# Altium project ESP-Project.PrjPcb
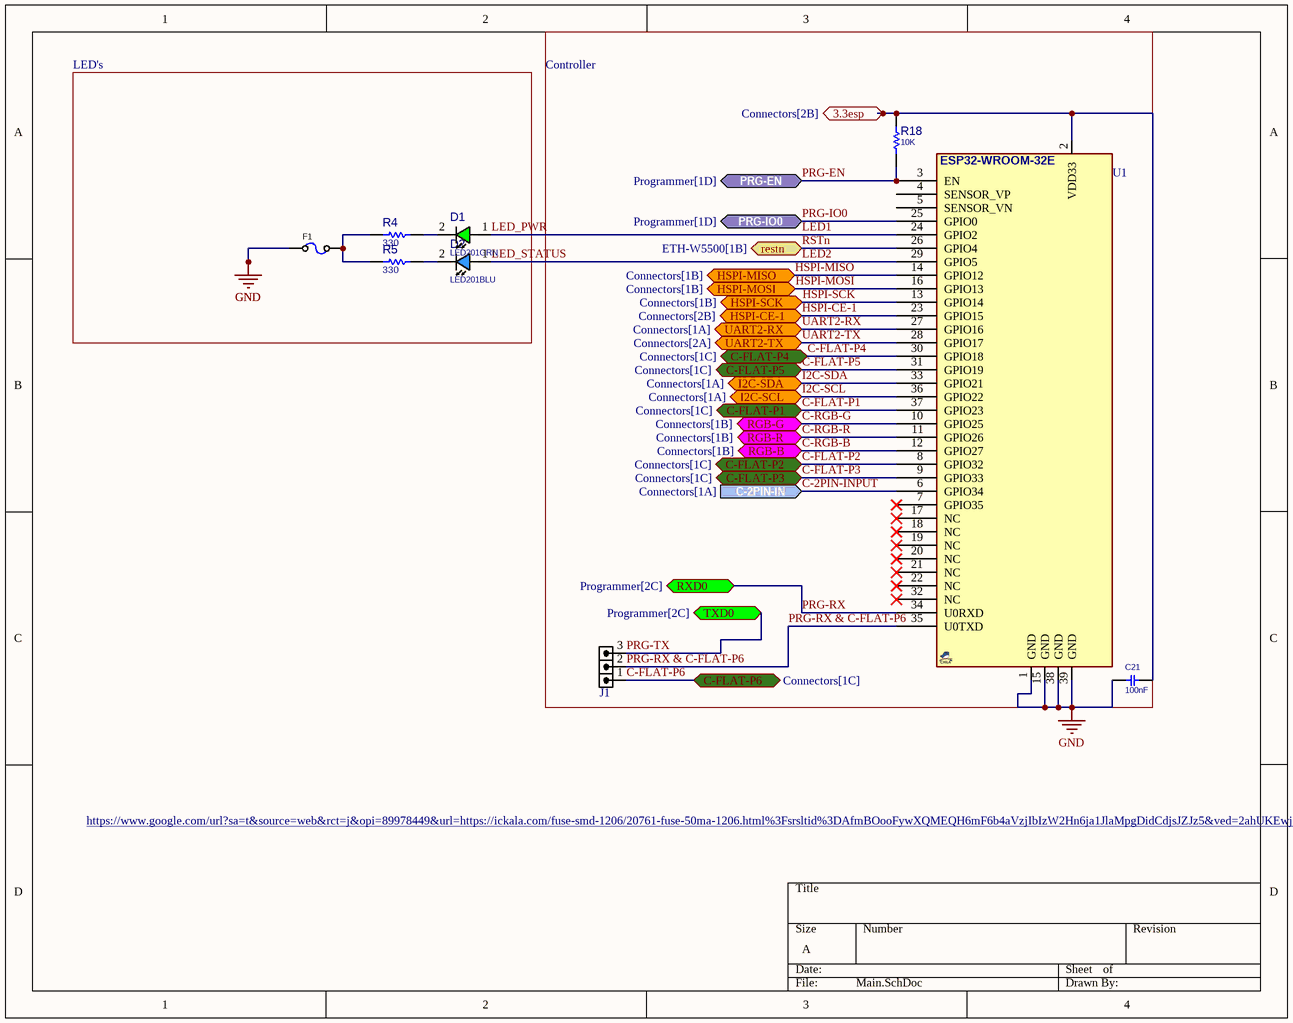
[diagram p0: Main.SchDoc]
5 sheets, 105 parts. Net scope: flat (ports and power ports of the same name join across sheets).
Board file: PCB1.PcbDoc
Sheets:
  Main.SchDoc
  ETH-W5500.SchDoc
  Programmer.SchDoc
  Power.SchDoc
  Connectors.SchDoc

## Sheet Main.SchDoc
size A; SheetNumber: 1; SheetTotal: 5

### Parts
C21  100nF  [C_CERM_D3]
D1  LED201GRN  [LED0201GRN]
D2  LED201BLU  [LED0201BLU]
F1  (no value)  [F1206]
J1  HDRM3  [HDR_M_1X3]  (value not drawn)
R4  330  [R0402]
R5  330  [R0402]
R18  10K  [R025W_AX04]
U1  ESP32-WROOM-32E  [ESP32S]  (value not drawn)

### Blocks framed on the sheet
LED's: D1 D2 F1 R4 R5
Controller: C21 J1 R18 U1

### Ports
3.3esp (bidir, see Connectors[2B]), C-2PIN-IN (in, see Connectors[1A]), C-FLAT-P1 (bidir, see Connectors[1C]), C-FLAT-P2 (bidir, see Connectors[1C]), C-FLAT-P3 (bidir, see Connectors[1C]), C-FLAT-P4 (bidir, see Connectors[1C]), C-FLAT-P5 (bidir, see Connectors[1C]), C-FLAT-P6 (bidir, see Connectors[1C]), HSPI-CE-1 (bidir, see Connectors[2B]), HSPI-MISO (bidir, see Connectors[1B]), HSPI-MOSI (bidir, see Connectors[1B]), HSPI-SCK (bidir, see Connectors[1B]), I2C-SCL (bidir, see Connectors[1A]), I2C-SDA (bidir, see Connectors[1A]), PRG-EN (bidir, see Programmer[1D]), PRG-IO0 (bidir, see Programmer[1D]), restn (bidir, see ETH-W5500[1B]), RGB-B (bidir, see Connectors[1B]), RGB-G (bidir, see Connectors[1B]), RGB-R (bidir, see Connectors[1B]), RXD0 (bidir, see Programmer[2C]), TXD0 (bidir, see Programmer[2C]), UART2-RX (bidir, see Connectors[1A]), UART2-TX (bidir, see Connectors[2A])

### Nets
GND: C21.1 F1.1 U1.1(GND) U1.15(GND) U1.38(GND) U1.39(GND)
3v3.: C21.2 R18.2 U1.2(VDD33) ; port 3.3esp
C-2PIN-INPUT: U1.6(GPIO34) ; port C-2PIN-IN
C-FLAT-P1: U1.37(GPIO23) ; port C-FLAT-P1
C-FLAT-P2: U1.8(GPIO32) ; port C-FLAT-P2
C-FLAT-P3: U1.9(GPIO33) ; port C-FLAT-P3
C-FLAT-P4: U1.30(GPIO18) ; port C-FLAT-P4
C-FLAT-P5: U1.31(GPIO19) ; port C-FLAT-P5
C-FLAT-P6: J1.1 ; port C-FLAT-P6
C-RGB-B: U1.12(GPIO27) ; port RGB-B
C-RGB-G: U1.10(GPIO25) ; port RGB-G
C-RGB-R: U1.11(GPIO26) ; port RGB-R
HSPI-CE-1: U1.23(GPIO15) ; port HSPI-CE-1
HSPI-MISO: U1.14(GPIO12) ; port HSPI-MISO
HSPI-MOSI: U1.16(GPIO13) ; port HSPI-MOSI
HSPI-SCK: U1.13(GPIO14) ; port HSPI-SCK
I2C-SCL: U1.36(GPIO22) ; port I2C-SCL
I2C-SDA: U1.33(GPIO21) ; port I2C-SDA
LED1: D1.1(ANODE) U1.24(GPIO2)  [also labelled LED_PWR]
LED2: D2.1(ANODE) U1.29(GPIO5)  [also labelled LED_STATUS]
PRG-EN: R18.1 U1.3(EN) ; port PRG-EN
PRG-IO0: U1.25(GPIO0) ; port PRG-IO0
PRG-RX: U1.34(U0RXD) ; port RXD0
PRG-RX & C-FLAT-P6: J1.2 U1.35(U0TXD)
PRG-TX: J1.3 ; port TXD0
RSTn: U1.26(GPIO4) ; port restn  [project net restn]
UART2-RX: U1.27(GPIO16) ; port UART2-RX
UART2-TX: U1.28(GPIO17) ; port UART2-TX
NetD1_2: D1.2(CATHODE) R4.2
NetD2_2: D2.2(CATHODE) R5.2
NetF1_2: F1.2 R4.1 R5.1

Not connected (* = marked no-connect by the designer): U1 4(SENSOR_VP) 5(SENSOR_VN) 7(GPIO35)* 17(NC)* 18(NC)* 19(NC)* 20(NC)* 21(NC)* 22(NC)* 32(NC)*

### Notes on the sheet
- https://www.google.com/url?sa=t&source=web&rct=j&opi=89978449&url=https://ickala.com/fuse-smd-1206/20761-fuse-50ma-1206.html%3Fsrsltid%3DAfmBOooFywXQMEQH6mF6b4aVzjIbIzW2Hn6ja1JlaMpgDidCdjsJZJz5&ved=2ahUKEwjq692gmKuOAxWVVEEAHWFWFJQQFnoECBgQAQ&usg=AOvVaw3Zv6yv8cLdd4ct48txnz0A

### Library data of the parts
C21 = CAP_THD_CER: CAP, THD, CER MULTI LAYER,; DESC: CAP, CER MULTI LAYER,; MANF_P#: MANF_PART#; PARAM2: 50V; PRICE: 100= 1$; MANF: MANF; ASSEMBLY: ASSEMBLY; VALUE: 100nF
D1 = LED_SMD_0201_GRN: LED, SMD, 0201, GREEN; PARAM: 20mA, 570nm, 140° Angle; MANF: Kingbright; DESC: DESCRIPTION; MANF_P#: APG0603CGC; PARAM2: 2V, -40~85°C; ASSEMBLY: ASSEMBLY; PRICE: 0.5$; VALUE: LED201GRN
D2 = LED_SMD_0201_BLU: LED, SMD, 0201, BLUE; PARAM: 5mA, 470nm, 110° Angle; MANF: Lumex; DESC: DESCRIPTION; MANF_P#: SML-LX0201USBC-TR; PARAM2: 2.6V, -40~85°C; ASSEMBLY: ASSEMBLY; PRICE: 0.3$; VALUE: LED201BLU
F1 = FUSE_160mA_1206: Fuse, 160mA, 63VDC, 1206, SMD, Fast Acting; PARAM: 160mA; 63VDC; slow-blow; MANF: Holly Fuse; MANF_P#: 12T-0160L; PARAM2: PARAM2
J1 = HDR_M_1X3: CONN, HEADER, Male, pitch: 2.54mm, 3POS; VALUE: HDRM3
R4 R5 = RES_SMD: RESISTOR, SMD; PARAM: -W; DESC: DESCRIPTION; DIST#: MOUSER; PARAM2: 1%; MANF_P#: -; MANF: -; ASSEMBLY: ASSEMBLY; PRICE: 100= 0.5$; VALUE: 330
R18 = RES_THD: RESISTOR, THD; MANF_P#: RK73H1ETTP4701F; MANF: KOA SPEER; PARAM: 0.063W; DESC: DESCRIPTION; DIST#: MOUSER; PARAM2: 1%; ASSEMBLY: ASSEMBLY; PRICE: 100= 0.5$; VALUE: 10K
U1 = ESP32-WROOM-32E: WiFi with Bluetooth 4.0; MANF_P#: ESP32-WROOM-32E; VALUE: ESP32-WROOM-32E

## Sheet ETH-W5500.SchDoc
size A; SheetNumber: 2; SheetTotal: 5
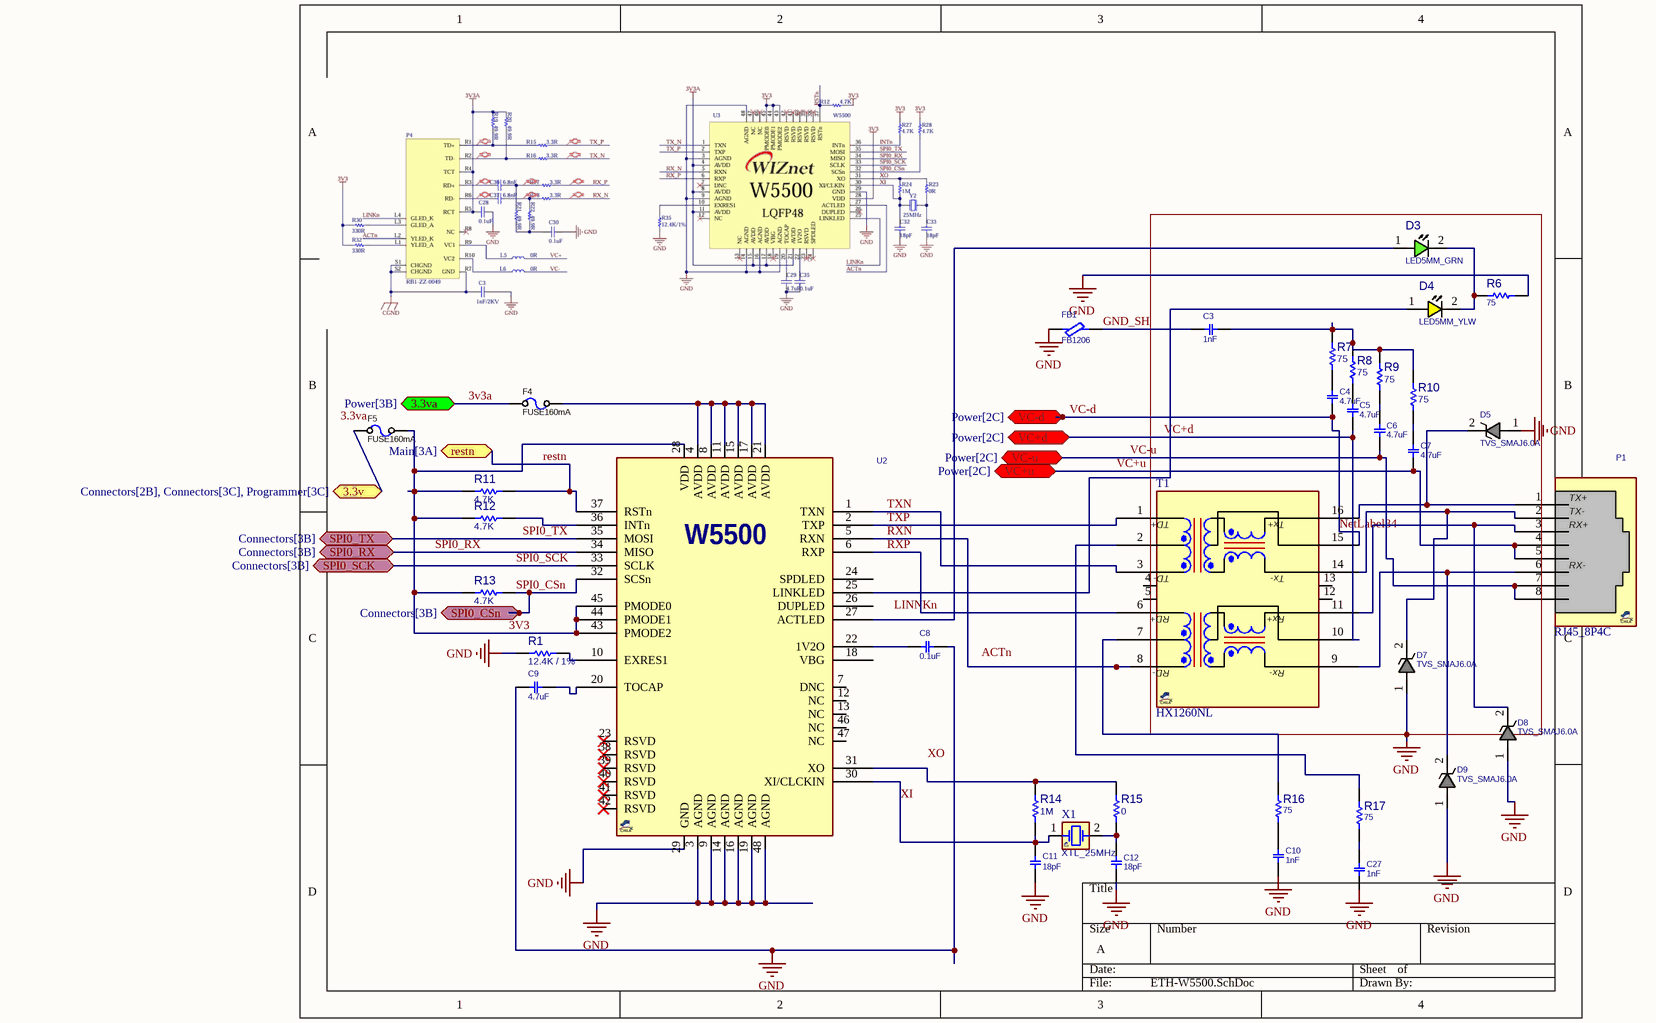
[diagram p1: ETH-W5500.SchDoc]

### Parts
C3  1nF  [C_CERM_D3]
C4  4.7uF  [C_CERM_D3]
C5  4.7uF  [C_CERM_D3]
C6  4.7uF  [C_CERM_D3]
C7  4.7uF  [C_CERM_D3]
C8  0.1uF  [C_CERM_D3]
C9  4.7uF  [C_CERM_D3]
C10  1nF  [C_CERM_D3]
C11  18pF  [C_CERM_D3]
C12  18pF  [C_CERM_D3]
C27  1nF  [C_CERM_D3]
D3  LED5MM_GRN  [LED5MM_GRN]
D4  LED5MM_YLW  [LED5MM_YLW]
D5  TVS_SMAJ6.0A  [D_SMA]
D7  TVS_SMAJ6.0A  [D_SMA]
D8  TVS_SMAJ6.0A  [D_SMA]
D9  TVS_SMAJ6.0A  [D_SMA]
F4  FUSE160mA  [F1206]
F5  FUSE160mA  [F1206]
FB1  FB1206  [L1206]
P1  RJ45_8P4C  [RJ45_8_RA_TD]
R1  12.4K / 1%  [R0603]
R6  75  [R025W_AX04]
R7  75  [R0402]
R8  75  [R0402]
R9  75  [R0402]
R10  75  [R0402]
R11  4.7K  [R1206]
R12  4.7K  [R1206]
R13  4.7K  [R1206]
R14  1M  [R0603]
R15  0  [R0603]
R16  75  [R025W_AX04]
R17  75  [R025W_AX04]
T1  HX1260NL  [SO_16_7W6H]
U2  (no value)  [QFG50_48]
X1  XTL_25MHz  [XTL_2_5032]

### Ports
3.3v (bidir, see Connectors[2B], Connectors[3C], Programmer[3C]), 3.3va (bidir, see Power[3B]), restn (bidir, see Main[3A]), SPI0_CSn (bidir, see Connectors[3B]), SPI0_RX (bidir, see Connectors[3B]), SPI0_SCK (bidir, see Connectors[3B]), SPI0_TX (bidir, see Connectors[3B]), VC+d (bidir, see Power[2C]), VC+u (bidir, see Power[2C]), VC-d (bidir, see Power[2C]), VC-u (bidir, see Power[2C])

### Nets
GND: C8.2 C9.1 C10.1 C11.1 C12.1 C27.1 D5.1 D7.1 D8.1 D9.1 FB1.1 R1.1 R6.2 U2.3(AGND) U2.9(AGND) U2.14(AGND) U2.16(AGND) U2.19(AGND) U2.29(GND) U2.48(AGND)
3V3: F5.2 R11.1 R12.1 R13.1 U2.28(VDD) U2.43(PMODE2) U2.44(PMODE1) U2.45(PMODE0)
3v3.: F5.1 ; port 3.3v
3v3a: F4.1 ; port 3.3va
GND_SH: C3.2 FB1.2
NetLabel34: C4.1 T1.15(CTX) ; port VC-d  [also labelled VC-d]
restn: R11.2 U2.37(RSTn) ; port restn
RXN: T1.8(RD-) U2.5(RXN)
RXP: T1.6(RD+) U2.6(RXP)
SPI0_CSn: R13.2 U2.32(SCSn) ; port SPI0_CSn
SPI0_RX: U2.34(MISO) ; port SPI0_RX
SPI0_SCK: U2.33(SCLK) ; port SPI0_SCK
SPI0_TX: U2.35(MOSI) ; port SPI0_TX
TXN: T1.3(TD-) U2.1(TXN)
TXP: T1.1(TD+) U2.2(TXP)
VC+d: C5.1 T1.10(CRX) ; port VC+d
VC+u: C7.1 P1.4(NC) P1.5(NC) ; port VC+u
VC-u: C6.1 P1.7(NC) P1.8(NC) ; port VC-u
XI: C11.2 R14.1 U2.30(XI/CLCKIN) X1.1(OSC1)
NetC3_1: C3.1 R7.2 R8.2 R9.2 R10.2
NetC4_2: C4.2 R7.1
NetC5_2: C5.2 R8.1
NetC6_2: C6.2 R9.1
NetC7_2: C7.2 R10.1
NetC8_1: C8.1 U2.22(1V2O)
NetC9_2: C9.2 U2.20(TOCAP)
NetC10_2: C10.2 R16.2
NetC12_2: C12.2 R15.1 X1.2(OSC2)
NetC27_2: C27.2 R17.2
NetD3_1: D3.1(ANODE) U2.27(ACTLED)
NetD3_2: D3.2(CATHODE) D4.2(CATHODE) R6.1
NetD4_1: D4.1(ANODE) U2.25(LINKLED)
NetD5_2: D5.2 P1.1(TX+) T1.16(TX+)
NetD7_2: D7.2 P1.2(TX-) T1.14(TX-)
NetD8_2: D8.2 P1.3(RX+) T1.11(RX+)
NetD9_2: D9.2 P1.6(RX-) T1.9(RX-)
NetF4_2: F4.2 U2.4(AVDD) U2.8(AVDD) U2.11(AVDD) U2.15(AVDD) U2.17(AVDD) U2.21(AVDD)
NetR1_2: R1.2 U2.10(EXRES1)
NetR12_2: R12.2 U2.36(INTn)
NetR14_2: R14.2 R15.2 U2.31(XO)
NetR16_1: R16.1 T1.7(CRD)
NetR17_1: R17.1 T1.2(CTD)

Not connected (* = marked no-connect by the designer): T1 4(NC_1) 5(NC_2) 12(NC_3) 13(NC_4); U2 7(DNC) 12(NC) 13(NC) 18(VBG) 23(RSVD)* 24(SPDLED) 26(DUPLED) 38(RSVD)* 39(RSVD)* 40(RSVD)* 41(RSVD)* 42(RSVD)* 46(NC) 47(NC)

### Notes on the sheet
- Labels drawn without touching a wire or pin: 3.3va, ACTn, LINNKn, XO
- (in symbol HX1260NL_SO16) Tx+; Tx-; Rx+; Rx-

### Library data of the parts
C3-C12 C27 = CAP_THD_CER: as C21 on sheet Main; PRICE: 100= 1$; MANF: MANF; ASSEMBLY: ASSEMBLY
  C3 C10 C27: VALUE: 1nF
  C4-C7 C9: VALUE: 4.7uF
  C8: VALUE: 0.1uF
  C11 C12: VALUE: 18pF
D3 = LED_THD_5MM_GRN: LED, THD, 5MM, GREEN; DESC: DESCRIPTION; MANF_P#: MANF_PART#; PARAM2: 2.2V; MANF: MANF; ASSEMBLY: ASSEMBLY; PRICE: PRICE; VALUE: LED5MM_GRN
D4 = LED_THD_5MM_YLW: LED, THD, 5MM, YELLOW; DESC: DESCRIPTION; MANF_P#: MANF_PART#; PARAM2: 2.2V; MANF: MANF; ASSEMBLY: ASSEMBLY; PRICE: PRICE; VALUE: LED5MM_YLW
D5 D7-D9 = TVS_SMAJ6.0A: TVS, ESD PROTECT; PARAM2: 6VRWM, 10.3VBR; PARAM: 400W, -55~150°C; MANF_P#: SMAJ6.0A; MANF: -; PRICE: 0.9$; VALUE: TVS_SMAJ6.0A
F4 F5 = FUSE_160mA_1206: as F1 on sheet Main; PARAM2: PARAM2; VALUE: FUSE160mA
FB1 = FBEAD_SMD_BLM31PG601: FERRITE_Bead, 1206, 1.5A, 80mOhm, 600@100MHz; MANF: Murata; MANF_P#: BLM31PG601SN1L; PARAM: 600@100MHz; PARAM2: 1.5A, 80mOhm; VALUE: FB1206
P1 = RJ45_8P4C_RATD: RJ45, 8P4C, RightAngle, Tab Down; MANF: WURTH; MANF_P#: 615008137121, 615008143721; PARAM2: 10/100BASE; PRICE: 1.2$; VALUE: RJ45_8P4C
R1 = RES_SMD: RESISTOR, SMD; PARAM: -W; DESC: DESCRIPTION; DIST#: MOUSER; MANF_P#: -; MANF: -; ASSEMBLY: ASSEMBLY; PRICE: 100= 0.5$; PARAM2: 1%; VALUE: 12.4K / 1%
R6 R16 R17 = RES_THD: as R18 on sheet Main; ASSEMBLY: ASSEMBLY; PRICE: 100= 0.5$; VALUE: 75
R7-R10 = RES_SMD: as R4 on sheet Main; MANF_P#: -; MANF: -; ASSEMBLY: ASSEMBLY; PRICE: 100= 0.5$; VALUE: 75
R11-R13 = RES_SMD_1206: RESISTOR, SMD; PARAM: 1%, 0.25W; DESC: DESCRIPTION; DIST#: MOUSER; MANF_P#: -; MANF: -; ASSEMBLY: ASSEMBLY; PRICE: -; PARAM2: -; VALUE: 4.7K
R14 R15 = RES_SMD_0603: RESISTOR, SMD; PARAM: 1%, 0.1W; DESC: DESCRIPTION; DIST#: MOUSER; MANF_P#: -; MANF: -; ASSEMBLY: ASSEMBLY; PRICE: -; PARAM2: -
  R14: VALUE: 1M
  R15: VALUE: 0
T1 = HX1260NL_SO16: Transformer, LAN, 100 Base-T , 1CT:1CT, 350uH; MANF: Pulse; PARAM2: 1CT:1CT, 350uH, 0~70°C; MANF_P#: HX1260NL; PARAM: LAN, 100 Base-T; PRICE: 4.5$; VALUE: HX1260NL
U2 = W5500_QFP48: Ethernet Controller, 10/100, SPI, DMA; MANF: WIZNET; MANF_P#: W5500
X1 = XTL_2_25MHz: Crystal 2 5X3.2mm; MANF_PART#2: ABM3C-25.000MHZ-D4Y-T; MANF_PART#3: 445I23D25M00000; DIST#: 815-ABM3-25-B2-T; DESC: CLOCK, CRYSTAL, 25MHz; MANF: ABRACON; PARAM: 20PPM; PARAM2: 18PF; MANF_P#: ABM3-25.000MHZ-B2-T; ASSEMBLY: ASSEMBLY; PRICE: *; Value: XTL_25MHz

## Sheet Programmer.SchDoc
size A; SheetNumber: 3; SheetTotal: 5
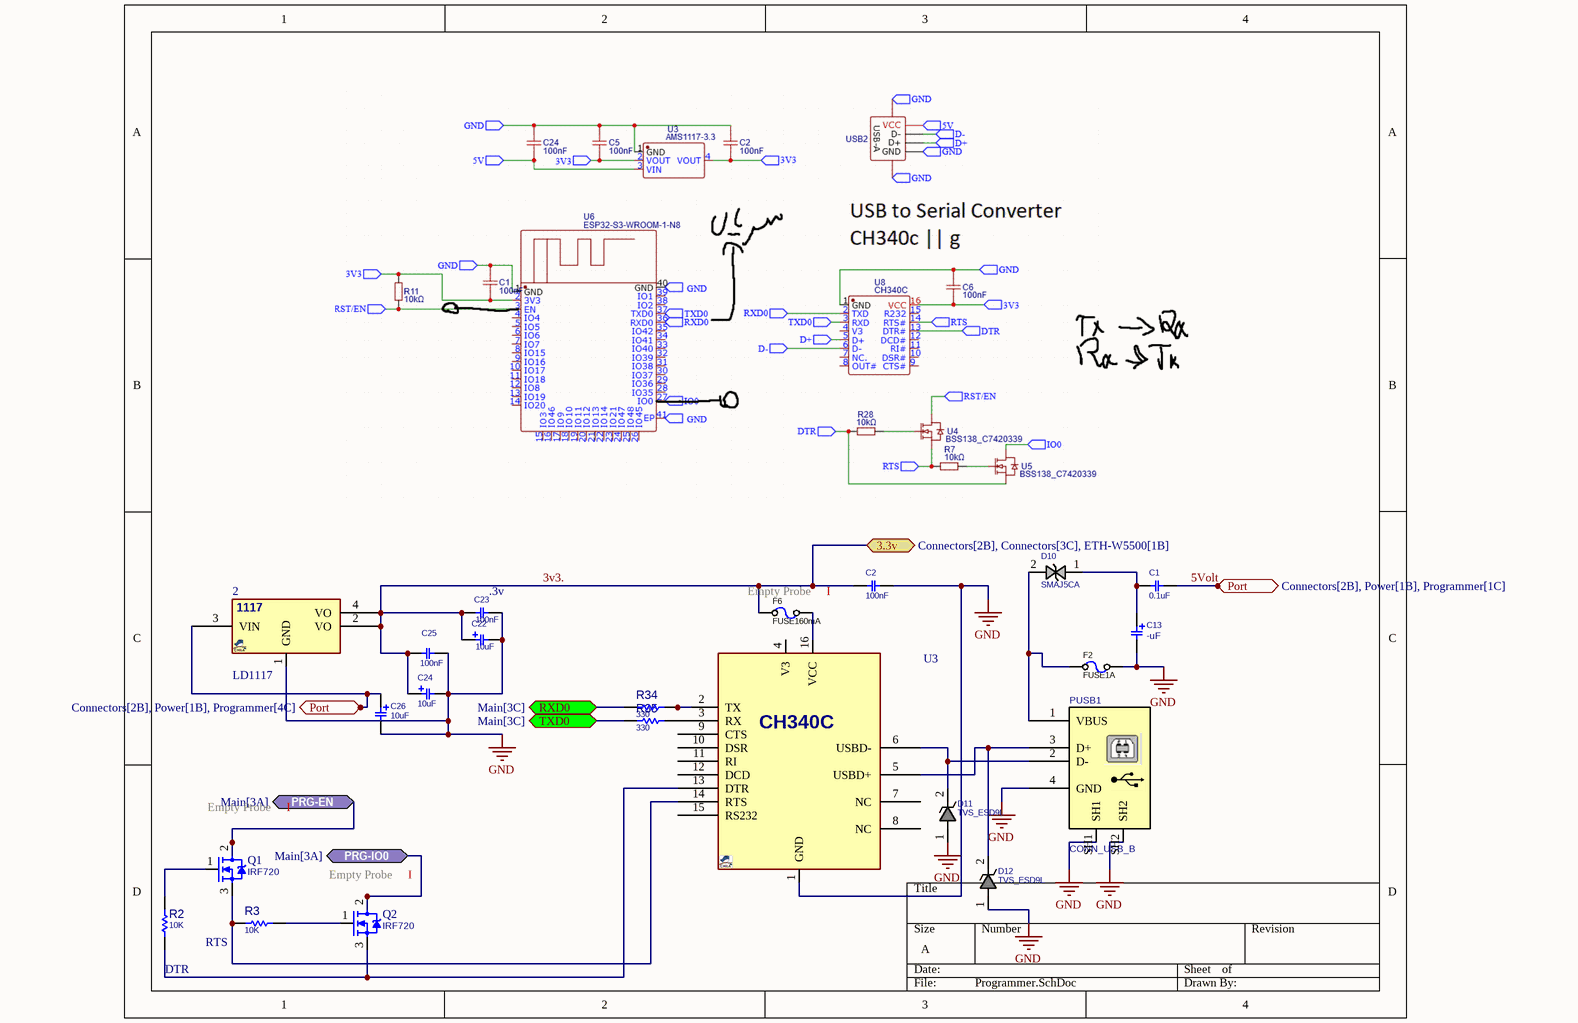
[diagram p2: Programmer.SchDoc]

### Parts
2  LD1117  [SOT223_4]
C1  0.1uF  [C_CERM_D4]
C2  100nF  [C_CERM_D3]
C13  -uF  [C_TN_3216]
C22  10uF  [C_EL_4X7]
C23  100nF  [C_CERM_D3]
C24  10uF  [C_EL_4X7]
C25  100nF  [C_CERM_D3]
C26  10uF  [C_EL_4X7]
D10  SMAJ5CA  [D_SMA]
D11  TVS_ESD9L  [D_SOD923]
D12  TVS_ESD9L  [D_SOD923]
F2  FUSE1A  [F2920]
F6  FUSE160mA  [F1206]
PUSB1  CONN_USB_B  [USB_B_RA_THD]
Q1  IRF720  [TO220_3]
Q2  IRF720  [TO220_3]
R2  10K  [R025W_AX04]
R3  10K  [R025W_AX04]
R34  330  [R025W_AX04]
R35  330  [R025W_AX04]
U3  CH340C  [SO_16]  (value not drawn)

### Ports
3.3v (bidir, see Connectors[2B], Connectors[3C], ETH-W5500[1B]), Port (bidir, see Connectors[2B], Power[1B], Programmer[1C]), Port (bidir, see Connectors[2B], Power[1B], Programmer[4C]), PRG-EN (bidir, see Main[3A]), PRG-IO0 (bidir, see Main[3A]), RXD0 (bidir, see Main[3C]), TXD0 (bidir, see Main[3C])

### Nets
GND: 2.1(GND) C2.1 C13.2 C22.2 C23.2 C24.2 C25.2 C26.2 D11.1 D12.1 F2.1 PUSB1.4(GND) PUSB1.SH1 PUSB1.SH2 U3.1(GND)
3v3.: 2.2(VO) 2.4(VO) C2.2 C22.1 C23.1 C24.1 C25.1 F6.1 ; port 3.3v
5Volt: 2.3(VIN) C1.2 C26.1 ; port Port
PRG-EN: Q1.2(D) ; port PRG-EN
PRG-IO0: Q2.2(D) ; port PRG-IO0
PRG-RX: R34.1 ; port RXD0
PRG-TX: R35.1 ; port TXD0
NetC1_1: C1.1 C13.1 D10.1
NetD10_2: D10.2 F2.2 PUSB1.1(VBUS)
NetD11_2: D11.2 PUSB1.2(D-) U3.6(USBD-)
NetD12_2: D12.2 PUSB1.3(D+) U3.5(USBD+)
NetF6_2: F6.2 U3.16(VCC)
NetQ1_1: Q1.1(G) R2.2
NetQ1_3: Q1.3(S) R3.1 U3.14(RTS)
NetQ2_1: Q2.1(G) R3.2
NetQ2_3: Q2.3(S) R2.1 U3.13(DTR)
NetR34_2: R34.2 U3.2(TX)
NetR35_2: R35.2 U3.3(RX)

Not connected (* = marked no-connect by the designer): U3 4(V3) 7(NC) 8(NC) 9(CTS) 10(DSR) 11(RI) 12(DCD) 15(RS232)

### Notes on the sheet
- (near C23) .3v
- (near R2) DTR
- RTS
- (in symbol VREG_1117_SOT223) 1117

### Library data of the parts
2 = VREG_1117_SOT223: REG, Linear, LDO1V, 0.8A, SOT-223; MANF_P#: LD1117, LM1117, AMS1117, TLV1117, REG1117, NCP1117, LT1117, SPX1117; MANF: TI, ON, ST; PARAM2: 1.2/1.5/1.8/2.5/2.85/3.3/5V; PARAM: LDO1V, 0.8A; VALUE: LD1117
C1 = CAP_THD_CER_0.1uF_50v: CAP, THD, CER MULTI LAYER,; DESC: CAP, CER MULTI LAYER,; MANF_P#: MANF_PART#; PARAM2: 50V; PRICE: 100= 1$; MANF: MANF; ASSEMBLY: ASSEMBLY; VALUE: 0.1uF
C2 C23 C25 = CAP_THD_CER: as C21 on sheet Main; PRICE: 100= 1$; MANF: MANF; ASSEMBLY: ASSEMBLY; VALUE: 100nF
C13 = CAP_SMD_TAN_3216: CAP, SMD, TAN,; PARAM2: -V; VALUE: -uF
C22 C24 C26 = CAP_THD_EL_10u25V: CAP, THD, ELEC, 10uF, 25V; MANF_P#: MANF_PART#; PARAM: 25V; MANF: MANF; PARAM2: PARAM2; VALUE: 10uF
D10 = TVS_SMAJ5CA: TVS, ESD PROTECT, Bidirectional; MANF: Littelfuse; PARAM2: 5VR, 6.74VBR; PARAM: -65~150°C; MANF_P#: SMAJ5CA; PRICE: 0.5t@Paya; VALUE: SMAJ5CA
D11 D12 = TVS_ESD9L5: TVS, ESD PROTECT,; MANF_P#: ESD9L5.0ST5G; MANF: ON; PARAM: 5VRWM; VALUE: TVS_ESD9L
F2 = FUSE_PPTC1A_2920: Fuse, PPTC, 1A, 60v, 410mOhm, 2920; PARAM: 1A, 2A Itrip, 100A max, -40~85oC; MANF: Bel Fuse; MANF_P#: 0ZCF0100AF2A; PARAM2: 60VDC, 410mOhm; DESC: Resettable Fuse; PRICE: 0.4$; VALUE: FUSE1A
F6 = FUSE_160mA_1206: as F1 on sheet Main; PARAM2: PARAM2; VALUE: FUSE160mA
PUSB1 = CONN_USB_B_RA_THD: CONN, USB, B, R/A, THD; MANF_P#: 292304-1; MANF: TE Connectivity; VALUE: CONN_USB_B
Q1 Q2 = MOSN_IRF720_TO220: MOSFET, N-CH, 1.8RDS, 3.3A, 400VDS, 2~4VGSth; MANF: VISHAY, ON; ASSEMBLY: ASSEMBLY; MANF_P#: IRF720; PARAM2: 400VDS, 2~4VGSth; PARAM: 1.8RDS, 3.3A; VALUE: IRF720
R2 R3 R34 R35 = RES_THD: as R18 on sheet Main; ASSEMBLY: ASSEMBLY; PRICE: 100= 0.5$
  R2 R3: VALUE: 10K
  R34 R35: VALUE: 330
U3 = CH340C_SOP16: USB-UART; MANF_P#: CH340C; VALUE: CH340C; PACKAGE: SOP-16

## Sheet Power.SchDoc
size A; SheetNumber: 4; SheetTotal: 5
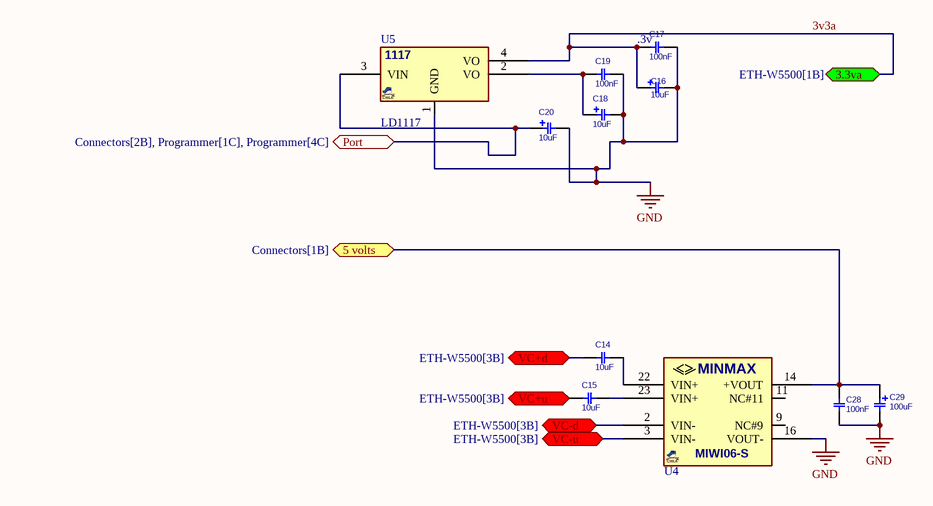
[diagram p3: Power.SchDoc]

### Parts
C14  10uF  [C_CERM_D3]
C15  10uF  [C_CERM_D3]
C16  10uF  [C_EL_4X7]
C17  100nF  [C_CERM_D3]
C18  10uF  [C_EL_4X7]
C19  100nF  [C_CERM_D3]
C20  10uF  [C_EL_4X7]
C28  100nF  [C_CERM_D3]
C29  100uF  [C_EL_4X7]
U4  MIWI06-24S05  [MINMAX_MIW6]  (value not drawn)
U5  LD1117  [SOT223_4]

### Ports
3.3va (bidir, see ETH-W5500[1B]), 5 volts (bidir, see Connectors[1B]), Port (bidir, see Connectors[2B], Programmer[1C], Programmer[4C]), VC+d (bidir, see ETH-W5500[3B]), VC+u (bidir, see ETH-W5500[3B]), VC-d (bidir, see ETH-W5500[3B]), VC-u (bidir, see ETH-W5500[3B])

### Nets
GND: C16.2 C17.2 C18.2 C19.2 C20.2 C28.1 C29.2 U4.16(VOUT-) U5.1(GND)
3v3a: C16.1 C17.1 U5.4(VO) ; port 3.3va
5Volt: C20.1 C28.2 C29.1 U4.14(+VOUT) U5.3(VIN) ; port 5 volts, port Port
NetLabel34: U4.2(VIN-) ; port VC-d
VC+d: C14.2 ; port VC+d
VC+u: C15.2 ; port VC+u
VC-u: U4.3(VIN-) ; port VC-u
NetC14_1: C14.1 U4.22(VIN+)
NetC15_1: C15.1 U4.23(VIN+)
NetC18_1: C18.1 C19.1 U5.2(VO)

Not connected (* = marked no-connect by the designer): U4 9(NC#9) 11(NC#11)

### Notes on the sheet
- (near C17) .3v
- (in symbol MIWI06-48S05) MINMAX; MIWI06-S
- (in symbol VREG_1117_SOT223) 1117

### Library data of the parts
C14 C15 C17 C19 C28 = CAP_THD_CER: as C21 on sheet Main; PRICE: 100= 1$; MANF: MANF; ASSEMBLY: ASSEMBLY
  C14 C15: VALUE: 10uF
  C17 C19 C28: VALUE: 100nF
C16 C18 C20 C29 = CAP_THD_EL_10u25V: as C22 on sheet Programmer; PARAM: 25V; MANF: MANF; PARAM2: PARAM2
  C16 C18 C20: VALUE: 10uF
  C29: VALUE: 100uF
U4 = MIWI06-48S05: DC-DC Converter, Isolated, 6W; MANF: MinMax; PARAM2: 18~75(48)Vin, 5Vout, 6W; PARAM: 1200mA, -40~85°C; DESC: https://www.minmax.com.tw/en/download/files/1673/MIWI06_Datasheet.pdf; MANF_P#: MIWI06-24S05; VALUE: MIWI06-24S05
U5 = VREG_1117_SOT223: as 2 on sheet Programmer; PARAM: LDO1V, 0.8A; VALUE: LD1117

## Sheet Connectors.SchDoc
size A3; SheetNumber: 5; SheetTotal: 5
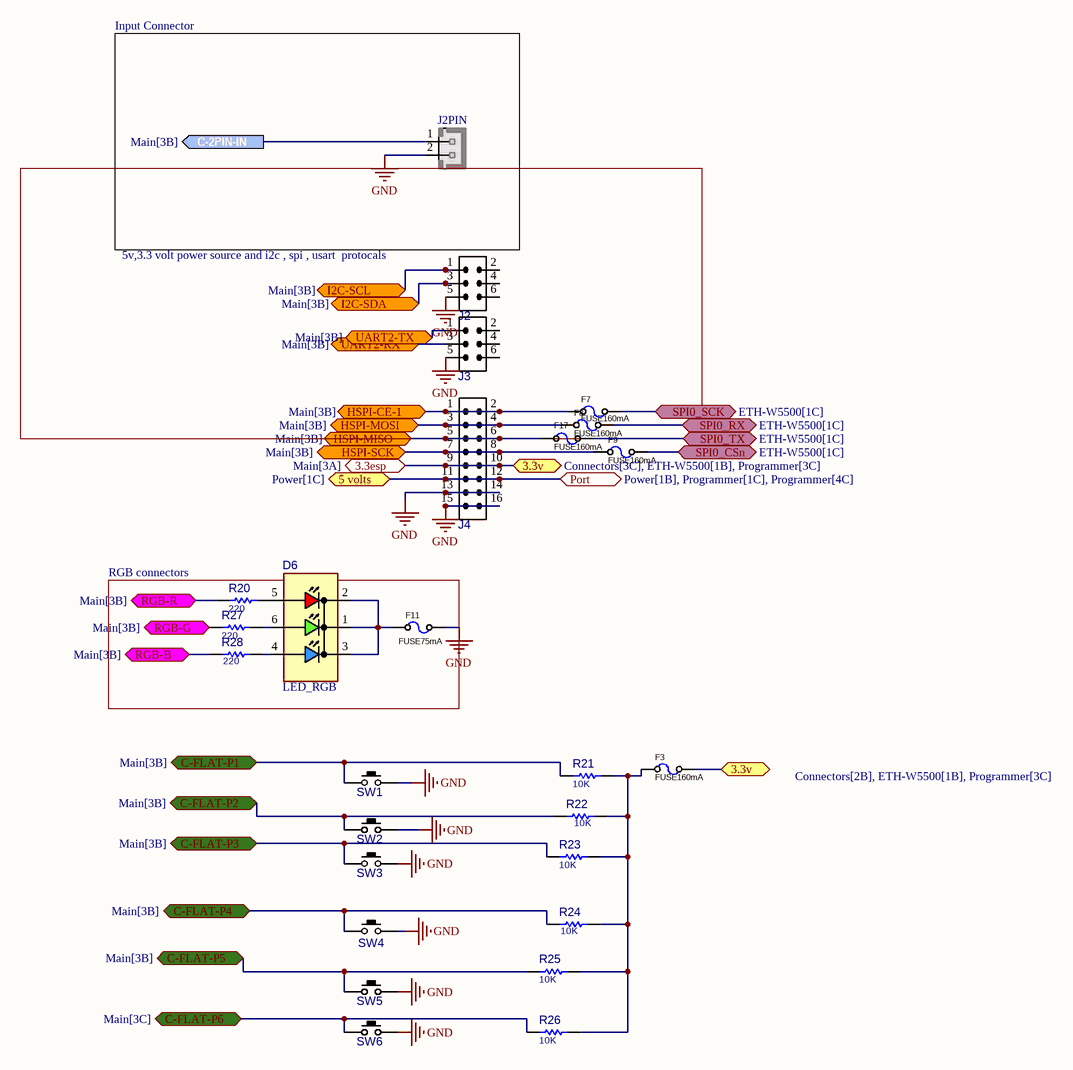
[diagram p4: Connectors.SchDoc]

### Parts
D6  LED_RGB  [LED5050RGB_6]
F3  FUSE160mA  [F1206]
F7  FUSE160mA  [F1206]
F8  FUSE160mA  [F1206]
F9  FUSE160mA  [F1206]
F11  FUSE75mA  [F1206]
F17  FUSE160mA  [F1206]
J2  IDC_2X3  [IDC_2X3]  (value not drawn)
J2PIN  HHDR_2  [XH_2]  (value not drawn)
J3  IDC_2X3  [IDC_2X3]  (value not drawn)
J4  IDC_2X8  [IDC_2X8]  (value not drawn)
R20  220  [R0402]
R21  10K  [R0402]
R22  10K  [R0402]
R23  10K  [R0402]
R24  10K  [R0402]
R25  10K  [R0402]
R26  10K  [R0402]
R27  220  [R0402]
R28  220  [R0402]
SW1  PUSHBUTTON  [SWPBS_SPST_6X3X5]  (value not drawn)
SW2  PUSHBUTTON  [SWPBS_SPST_6X3X5]  (value not drawn)
SW3  PUSHBUTTON  [SWPBS_SPST_6X3X5]  (value not drawn)
SW4  PUSHBUTTON  [SWPBS_SPST_6X3X5]  (value not drawn)
SW5  PUSHBUTTON  [SWPBS_SPST_6X3X5]  (value not drawn)
SW6  PUSHBUTTON  [SWPBS_SPST_6X3X5]  (value not drawn)

### Blocks framed on the sheet
Input Connector: J2PIN
5v,3.3 volt power source and i2c , spi , usart  protocals: F7 F8 F17 J2 J3
RGB connectors: D6 F11 R20 R27 R28

### Ports
3.3esp (bidir, see Main[3A]), 3.3v (bidir, see Connectors[2B], ETH-W5500[1B], Programmer[3C]), 3.3v (bidir, see Connectors[3C], ETH-W5500[1B], Programmer[3C]), 5 volts (bidir, see Power[1C]), C-2PIN-IN (out, see Main[3B]), C-FLAT-P1 (bidir, see Main[3B]), C-FLAT-P2 (bidir, see Main[3B]), C-FLAT-P3 (bidir, see Main[3B]), C-FLAT-P4 (bidir, see Main[3B]), C-FLAT-P5 (bidir, see Main[3B]), C-FLAT-P6 (bidir, see Main[3C]), HSPI-CE-1 (bidir, see Main[3B]), HSPI-MISO (bidir, see Main[3B]), HSPI-MOSI (bidir, see Main[3B]), HSPI-SCK (bidir, see Main[3B]), I2C-SCL (bidir, see Main[3B]), I2C-SDA (bidir, see Main[3B]), Port (bidir, see Power[1B], Programmer[1C], Programmer[4C]), RGB-B (bidir, see Main[3B]), RGB-G (bidir, see Main[3B]), RGB-R (bidir, see Main[3B]), SPI0_CSn (bidir, see ETH-W5500[1C]), SPI0_RX (bidir, see ETH-W5500[1C]), SPI0_SCK (bidir, see ETH-W5500[1C]), SPI0_TX (bidir, see ETH-W5500[1C]), UART2-RX (bidir, see Main[3B]), UART2-TX (bidir, see Main[3B])

### Nets
GND: F11.2 J2.5 J2PIN.2 J3.5 J4.13 J4.14 J4.15 J4.16 SW1.2(P3) SW2.2(P3) SW3.2(P3) SW4.2(P3) SW5.2(P3) SW6.2(P3)
3v3.: F3.2 J4.9 J4.10 ; port 3.3v, port 3.3esp
5Volt: J4.11 J4.12 ; port 5 volts, port Port
C-2PIN-INPUT: J2PIN.1 ; port C-2PIN-IN
C-FLAT-P1: R21.1 SW1.1(P1) ; port C-FLAT-P1
C-FLAT-P2: R22.1 SW2.1(P1) ; port C-FLAT-P2
C-FLAT-P3: R23.1 SW3.1(P1) ; port C-FLAT-P3
C-FLAT-P4: R24.1 SW4.1(P1) ; port C-FLAT-P4
C-FLAT-P5: R25.1 SW5.1(P1) ; port C-FLAT-P5
C-FLAT-P6: R26.1 SW6.1(P1) ; port C-FLAT-P6
C-RGB-B: R28.1 ; port RGB-B
C-RGB-G: R27.1 ; port RGB-G
C-RGB-R: R20.1 ; port RGB-R
HSPI-CE-1: F7.2 J4.1 J4.2 ; port HSPI-CE-1
HSPI-MISO: F17.2 J4.5 J4.6 ; port HSPI-MISO
HSPI-MOSI: F8.2 J4.3 J4.4 ; port HSPI-MOSI
HSPI-SCK: F9.2 J4.7 J4.8 ; port HSPI-SCK
I2C-SCL: J2.1 ; port I2C-SCL
I2C-SDA: J2.3 ; port I2C-SDA
SPI0_CSn: F9.1 ; port SPI0_CSn
SPI0_RX: F8.1 ; port SPI0_RX
SPI0_SCK: F7.1 ; port SPI0_SCK
SPI0_TX: F17.1 ; port SPI0_TX
UART2-RX: J3.3 ; port UART2-RX
UART2-TX: J3.1 ; port UART2-TX
NetD6_1: D6.1(RED) D6.2(GRN) D6.3(BLU) F11.1
NetD6_4: D6.4(AB) R28.2
NetD6_5: D6.5(AG) R20.2
NetD6_6: D6.6(AR) R27.2
NetF3_1: F3.1 R21.2 R22.2 R23.2 R24.2 R25.2 R26.2

Not connected (* = marked no-connect by the designer): J2 2 4 6; J3 2 4 6

### Library data of the parts
D6 = LED_SMD_RGB_5050_CC: LED, SMD, RGB COMMON CATHODE; PARAM: 30mA, 120°; DESC: DESCRIPTION; PARAM2: RED2V, GRN3.2V, BLU3.2V; MANF_P#: -; MANF: -; ASSEMBLY: ASSEMBLY; PRICE: 95t@JAVAN; VALUE: LED_RGB
F3 F7-F9 F11 F17 = FUSE_160mA_1206: as F1 on sheet Main; PARAM2: PARAM2
  F3 F7-F9 F17: VALUE: FUSE160mA
  F11: VALUE: FUSE75mA
J2 J3 = IDC_2X3: CONN, IDC, Male, pitch: 2.54mm, 6POS; VALUE: IDC_2X3
J2PIN = XH_2: JST-XH pitch: 2.5mm; VALUE: HHDR_2
J4 = IDC_2X8: CONN, IDC, Male, pitch: 2.54mm, 16POS; VALUE: IDC_2X8
R20-R28 = RES_SMD: as R4 on sheet Main; MANF_P#: -; MANF: -; ASSEMBLY: ASSEMBLY; PRICE: 100= 0.5$
  R20 R27 R28: VALUE: 220
  R21-R26: VALUE: 10K
SW1-SW6 = SWPBS_SPST_6X3X4: SWITCH, PUSH BUTTON, TACTILE, SMD, SPST, 6X3.5X4.3mm; MANF: Panasonic; DESC: DESCRIPTION; MANF_P#: EVQ-PNF04M; VALUE: PUSHBUTTON; ASSEMBLY: ASSEMBLY; PARAM: PARAM; PRICE: PRICE

## Nets that join several sheets
GND: Main (6 pins), ETH-W5500 (20 pins), Programmer (15 pins), Power (9 pins), Connectors (14 pins)
3v3.: Main (C21.2 R18.2 U1.2), ETH-W5500 (F5.1), Programmer (8 pins), Connectors (F3.2 J4.9 J4.10)
3v3a: ETH-W5500 (F4.1), Power (C16.1 C17.1 U5.4)
5Volt: Programmer (2.3 C1.2 C26.1), Power (5 pins), Connectors (J4.11 J4.12)
C-2PIN-INPUT: Main (U1.6), Connectors (J2PIN.1)
C-FLAT-P1: Main (U1.37), Connectors (R21.1 SW1.1)
C-FLAT-P2: Main (U1.8), Connectors (R22.1 SW2.1)
C-FLAT-P3: Main (U1.9), Connectors (R23.1 SW3.1)
C-FLAT-P4: Main (U1.30), Connectors (R24.1 SW4.1)
C-FLAT-P5: Main (U1.31), Connectors (R25.1 SW5.1)
C-FLAT-P6: Main (J1.1), Connectors (R26.1 SW6.1)
C-RGB-B: Main (U1.12), Connectors (R28.1)
C-RGB-G: Main (U1.10), Connectors (R27.1)
C-RGB-R: Main (U1.11), Connectors (R20.1)
HSPI-CE-1: Main (U1.23), Connectors (F7.2 J4.1 J4.2)
HSPI-MISO: Main (U1.14), Connectors (F17.2 J4.5 J4.6)
HSPI-MOSI: Main (U1.16), Connectors (F8.2 J4.3 J4.4)
HSPI-SCK: Main (U1.13), Connectors (F9.2 J4.7 J4.8)
I2C-SCL: Main (U1.36), Connectors (J2.1)
I2C-SDA: Main (U1.33), Connectors (J2.3)
NetLabel34: ETH-W5500 (C4.1 T1.15), Power (U4.2)
PRG-EN: Main (R18.1 U1.3), Programmer (Q1.2)
PRG-IO0: Main (U1.25), Programmer (Q2.2)
PRG-RX: Main (U1.34), Programmer (R34.1)
PRG-TX: Main (J1.3), Programmer (R35.1)
restn: Main (U1.26), ETH-W5500 (R11.2 U2.37)
SPI0_CSn: ETH-W5500 (R13.2 U2.32), Connectors (F9.1)
SPI0_RX: ETH-W5500 (U2.34), Connectors (F8.1)
SPI0_SCK: ETH-W5500 (U2.33), Connectors (F7.1)
SPI0_TX: ETH-W5500 (U2.35), Connectors (F17.1)
UART2-RX: Main (U1.27), Connectors (J3.3)
UART2-TX: Main (U1.28), Connectors (J3.1)
VC+d: ETH-W5500 (C5.1 T1.10), Power (C14.2)
VC+u: ETH-W5500 (C7.1 P1.4 P1.5), Power (C15.2)
VC-u: ETH-W5500 (C6.1 P1.7 P1.8), Power (U4.3)